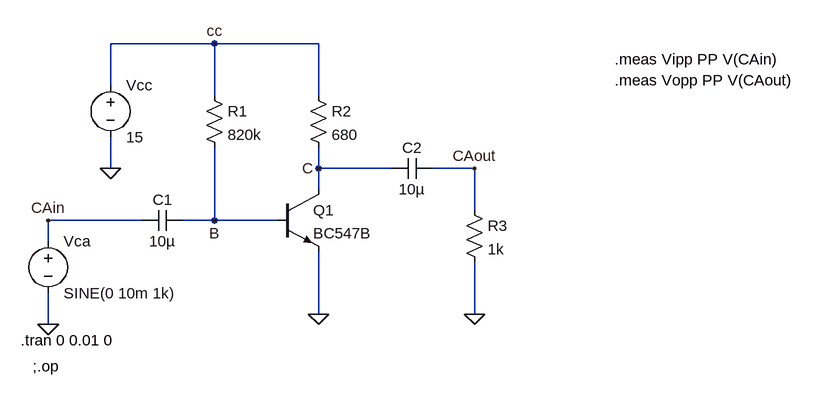
[diagram p0: schematic Draft1.asc]
Draft1.asc, the LTspice schematic file:
Version 4
SHEET 1 1032 680
WIRE 128 -16 -32 -16
WIRE 288 -16 128 -16
WIRE -32 48 -32 -16
WIRE 128 64 128 -16
WIRE 288 64 288 -16
WIRE -32 176 -32 128
WIRE 288 176 288 144
WIRE 400 176 288 176
WIRE 528 176 464 176
WIRE 288 208 288 176
WIRE 528 240 528 176
WIRE 16 256 -128 256
WIRE 128 256 128 144
WIRE 128 256 80 256
WIRE 224 256 128 256
WIRE -128 288 -128 256
WIRE 288 400 288 304
WIRE 528 400 528 320
WIRE -128 416 -128 368
FLAG -32 176 0
FLAG 288 400 0
FLAG -128 416 0
FLAG 128 -16 cc
FLAG -128 256 CAin
FLAG 528 400 0
FLAG 528 176 CAout
FLAG 128 256 B
FLAG 288 176 C
SYMBOL res 112 48 R0
SYMATTR InstName R1
SYMATTR Value 820k
SYMBOL res 272 48 R0
SYMATTR InstName R2
SYMATTR Value 680
SYMBOL voltage -32 32 R0
WINDOW 123 0 0 Left 0
WINDOW 39 0 0 Left 0
SYMATTR InstName Vcc
SYMATTR Value 15
SYMBOL npn 224 208 R0
SYMATTR InstName Q1
SYMATTR Value BC547B
SYMBOL cap 80 240 R90
WINDOW 0 0 32 VBottom 2
WINDOW 3 32 32 VTop 2
SYMATTR InstName C1
SYMATTR Value 10µ
SYMBOL cap 464 160 R90
WINDOW 0 0 32 VBottom 2
WINDOW 3 32 32 VTop 2
SYMATTR InstName C2
SYMATTR Value 10µ
SYMBOL voltage -128 272 R0
WINDOW 123 0 0 Left 0
WINDOW 39 0 0 Left 0
SYMATTR InstName Vca
SYMATTR Value SINE(0 10m 1k)
SYMBOL res 512 224 R0
SYMATTR InstName R3
SYMATTR Value 1k
TEXT -170 440 Left 2 !.tran 0 0.01 0
TEXT -152 480 Left 2 !;.op
TEXT 744 8 Left 2 !.meas Vipp PP V(CAin)
TEXT 744 40 Left 2 !.meas Vopp PP V(CAout)

The netlist it stands for:
* Draft1.asc
R1 cc B 820k
R2 cc C 680
Vcc cc 0 15
Q1 C B 0 0 BC547B
C1 B CAin 10µ
C2 CAout C 10µ
Vca CAin 0 SINE(0 10m 1k)
R3 CAout 0 1k
.model NPN NPN
.model PNP PNP
.lib standard.bjt
.tran 0 0.01 0
;.op
.meas Vipp PP V(CAin)
.meas Vopp PP V(CAout)
.backanno
.end